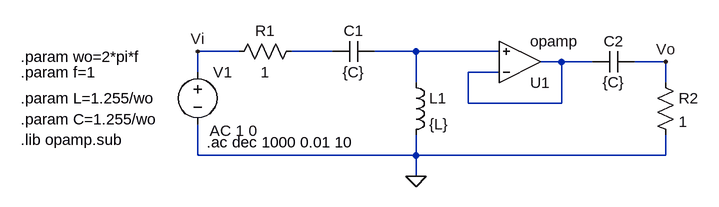
[diagram p0: schematic TS4_pasivo.asc]
TS4_pasivo.asc, the LTspice schematic file:
Version 4
SHEET 1 880 680
WIRE 48 48 -16 48
WIRE 192 48 128 48
WIRE 320 48 256 48
WIRE 448 48 320 48
WIRE 544 64 512 64
WIRE 592 64 544 64
WIRE 704 64 656 64
WIRE -16 80 -16 48
WIRE 448 80 400 80
WIRE 320 96 320 48
WIRE 704 96 704 64
WIRE 400 128 400 80
WIRE 544 128 544 64
WIRE 544 128 400 128
WIRE -16 208 -16 160
WIRE 320 208 320 176
WIRE 320 208 -16 208
WIRE 704 208 704 176
WIRE 704 208 320 208
WIRE 320 240 320 208
FLAG 320 240 0
FLAG -16 48 Vi
FLAG 704 64 Vo
SYMBOL res 144 32 R90
WINDOW 0 0 56 VBottom 2
WINDOW 3 32 56 VTop 2
SYMATTR InstName R1
SYMATTR Value 1
SYMBOL cap 256 32 R90
WINDOW 0 0 32 VBottom 2
WINDOW 3 32 32 VTop 2
SYMATTR InstName C1
SYMATTR Value {C}
SYMBOL ind 304 80 R0
SYMATTR InstName L1
SYMATTR Value {L}
SYMBOL cap 656 48 R90
WINDOW 0 0 32 VBottom 2
WINDOW 3 32 32 VTop 2
SYMATTR InstName C2
SYMATTR Value {C}
SYMBOL res 688 80 R0
SYMATTR InstName R2
SYMATTR Value 1
SYMBOL OpAmps\\opamp 480 128 M180
SYMATTR InstName U1
SYMBOL voltage -16 64 R0
WINDOW 123 19 106 Left 2
WINDOW 39 0 0 Left 0
SYMATTR InstName V1
SYMATTR Value ""
SYMATTR Value2 AC 1 0
TEXT -288 56 Left 2 !.param wo=2*pi*f
TEXT -288 80 Left 2 !.param f=1
TEXT -288 120 Left 2 !.param L=1.255/wo
TEXT -288 152 Left 2 !.param C=1.255/wo
TEXT -2 188 Left 2 !.ac dec 1000 0.01 10
TEXT -288 184 Left 2 !.lib opamp.sub

The netlist it stands for:
* TS4_pasivo.asc
R1 N001 Vi 1
C1 N002 N001 {C}
L1 N002 0 {L}
C2 Vo N003 {C}
R2 Vo 0 1
XU1 N003 N002 N003 opamp Aol=100K GBW=10Meg  ; pins invin noninvin out
V1 Vi 0 AC 1 0
.param wo=2*pi*f
.param f=1
.param L=1.255/wo
.param C=1.255/wo
.ac dec 1000 0.01 10
.lib opamp.sub
.backanno
.end